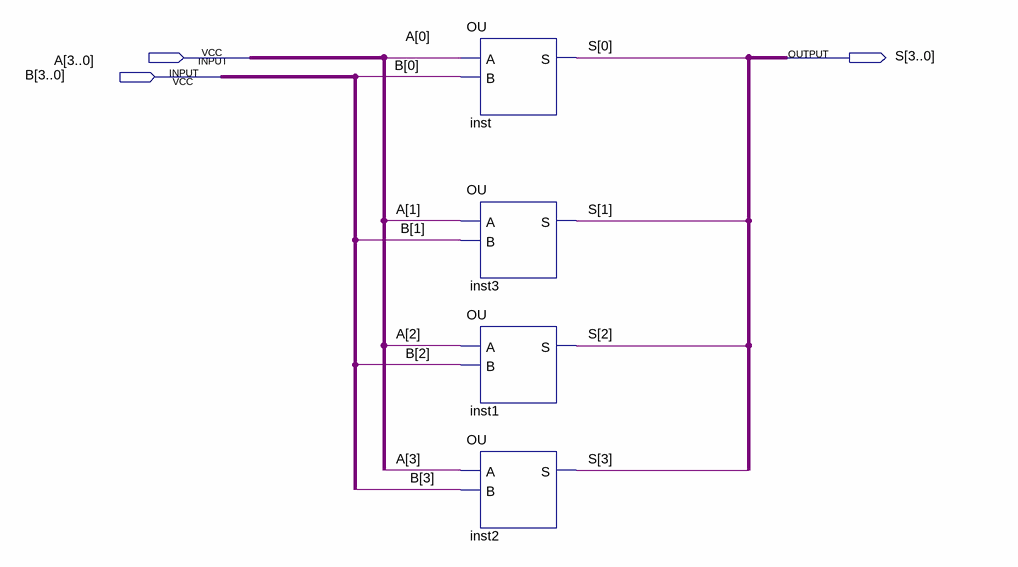
[diagram p0: schematic sheet]
// Quartus schematic OU_4bits.bdf as structural Verilog: 4 symbols, 3 pins
module OU_4bits (
  input  [3:0] A,
  input  [3:0] B,
  output [3:0] S
);

  OU inst (.A(A[0]), .B(B[0]), .S(S[0]));
  OU inst3 (.A(A[1]), .B(B[1]), .S(S[1]));
  OU inst1 (.A(A[2]), .B(B[2]), .S(S[2]));
  OU inst2 (.A(A[3]), .B(B[3]), .S(S[3]));
endmodule
